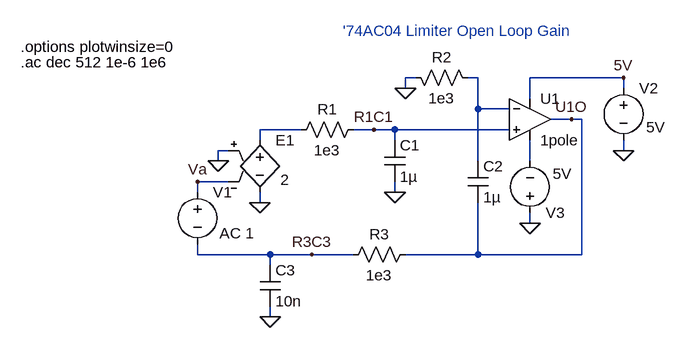
[diagram p0: schematic aclim03.asc]
aclim03.asc, the LTspice schematic file:
Version 4
SHEET 1 1260 864
WIRE -80 -16 -96 -16
WIRE 16 -16 0 -16
WIRE 240 -16 96 -16
WIRE -96 0 -96 -16
WIRE 240 0 240 -16
WIRE 96 16 96 -16
WIRE 16 32 16 -16
WIRE 64 32 16 32
WIRE 160 48 128 48
WIRE 176 48 160 48
WIRE -256 64 -320 64
WIRE -144 64 -176 64
WIRE -112 64 -144 64
WIRE 64 64 -112 64
WIRE -320 80 -320 64
WIRE -112 80 -112 64
WIRE -368 96 -384 96
WIRE 240 96 240 80
WIRE -384 112 -384 96
WIRE 16 112 16 32
WIRE 96 112 96 80
WIRE -368 144 -416 144
WIRE -416 160 -416 144
WIRE -112 160 -112 144
WIRE -320 176 -320 160
WIRE 96 208 96 192
WIRE -416 256 -416 240
WIRE -304 256 -416 256
WIRE -240 256 -304 256
WIRE -176 256 -240 256
WIRE 16 256 16 176
WIRE 16 256 -96 256
WIRE 176 256 176 48
WIRE 176 256 16 256
WIRE -304 272 -304 256
WIRE -304 352 -304 336
FLAG -416 144 Va
FLAG -112 160 0
FLAG -144 64 R1C1
FLAG -320 176 0
FLAG 240 96 0
FLAG 240 -16 5V
FLAG 160 48 U1O
FLAG -384 112 0
FLAG -304 352 0
FLAG -240 256 R3C3
FLAG -96 0 0
FLAG 96 208 0
SYMBOL Voltage -416 144 R0
WINDOW 123 34 79 Left 0
WINDOW 39 0 0 Left 0
WINDOW 3 -55 136 Left 0
SYMATTR Value2 AC 1
SYMATTR Value ""
SYMATTR InstName V1
SYMBOL cap -128 80 R0
SYMATTR InstName C1
SYMATTR Value 1µ
SYMBOL res -272 80 R270
WINDOW 0 32 56 VTop 0
WINDOW 3 0 56 VBottom 0
SYMATTR InstName R1
SYMATTR Value 1e3
SYMBOL e -320 64 R0
WINDOW 3 32 77 Left 0
SYMATTR Value 2
SYMATTR InstName E1
SYMBOL Opamps\\1pole 96 48 R0
SYMATTR InstName U1
SYMBOL Voltage 240 -16 R0
WINDOW 123 34 79 Left 0
WINDOW 39 0 0 Left 0
WINDOW 3 35 76 Left 0
SYMATTR Value 5V
SYMATTR InstName V2
SYMBOL cap 0 112 R0
SYMATTR InstName C2
SYMATTR Value 1µ
SYMBOL res -192 272 R270
WINDOW 0 32 56 VTop 0
WINDOW 3 0 56 VBottom 0
SYMATTR InstName R3
SYMATTR Value 1e3
SYMBOL cap -320 272 R0
SYMATTR InstName C3
SYMATTR Value 10n
SYMBOL res -96 -32 M90
WINDOW 0 0 56 VBottom 0
WINDOW 3 32 56 VTop 0
SYMATTR InstName R2
SYMATTR Value 1e3
SYMBOL Voltage 96 208 M180
WINDOW 123 34 79 Left 0
WINDOW 39 0 0 Left 0
WINDOW 3 35 76 Left 0
SYMATTR Value 5V
SYMATTR InstName V3
TEXT -192 -88 Left 0 ;'74AC04 Limiter Open Loop Gain
TEXT -688 -40 Left 0 !.ac dec 512 1e-6 1e6
TEXT -688 -64 Left 0 !.options plotwinsize=0

The netlist it stands for:
* aclim03.asc
V1 Va R3C3 AC 1
C1 R1C1 0 1µ
R1 N002 R1C1 1e3
E1 N002 0 0 Va 2
* U1: 1pole (symbol Opamps\1pole not available, pins judged from their places): In+=R1C1 In-=N001 V+=5V V-=N003 OUT=U1O
V2 5V 0 5V
C2 N001 U1O 1µ
R3 R3C3 U1O 1e3
C3 R3C3 0 10n
R2 0 N001 1e3
V3 0 N003 5V
* '74AC04 Limiter Open Loop Gain
.ac dec 512 1e-6 1e6
.options plotwinsize=0
.backanno
.end